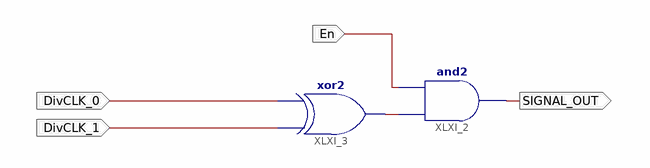
[diagram p0: schematic sheet 1]
// Xilinx ISE schematic BOOBOO_ST.sch (spartan3e) as structural Verilog: 2 symbols, 4 ports
module BOOBOO_ST (
  input  DivCLK_0,
  input  DivCLK_1,
  input  En,
  output SIGNAL_OUT
);

  wire XLXN_3;

  and XLXI_2 (SIGNAL_OUT, XLXN_3, En);
  xor XLXI_3 (XLXN_3, DivCLK_1, DivCLK_0);
endmodule
